# Altium schematic sheet 7.EEPROM.SchDoc: EEPROM
size A; SheetNumber: 7; SheetTotal: 16
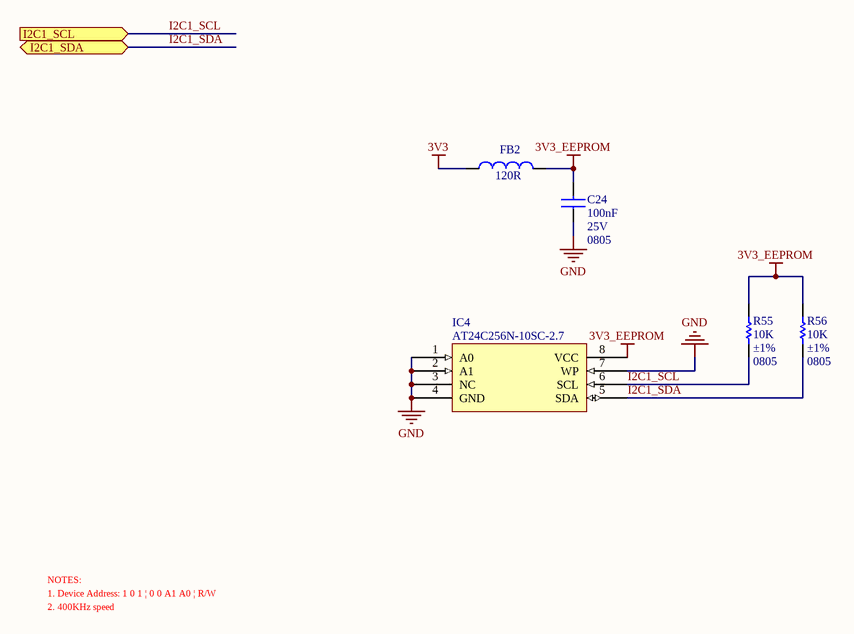
[diagram p0: 7.EEPROM.SchDoc]

## Parts
C24  Capacitance: 100nF  Voltage - Rated: 25V  Package / Case: 0805  [CAPC2012X100N_EIA0805]  (hidden comment: CAP_NP)
FB2  Impedance: 120R  [FILC2012X100N_EIA0805]  (hidden comment: BEAD)
IC4  Manufacturer Part Number: AT24C256N-10SC-2.7  [SOIC127P600X175-8N]  (hidden comment: AT24C256)
R55  Resistance (Ohm): 10K  Tolerance: ±1%  Package / Case: 0805  [RESC2013X65N_EIA0805]  (hidden comment: RES)
R56  Resistance (Ohm): 10K  Tolerance: ±1%  Package / Case: 0805  [RESC2013X65N_EIA0805]  (hidden comment: RES)

## Ports
I2C1_SCL (in), I2C1_SDA (bidir)

## Nets
3V3: FB2.1
3V3_EEPROM: C24.2 FB2.2 IC4.8(VCC) R55.1 R56.1
GND: C24.1 IC4.1(A0) IC4.2(A1) IC4.3(NC) IC4.4(GND) IC4.7(WP)
I2C1_SCL: IC4.6(SCL) R55.2 ; port I2C1_SCL
I2C1_SDA: IC4.5(SDA) R56.2 ; port I2C1_SDA

## Notes on the sheet
- NOTES:
- 1. Device Address: 1 0 1 | 0 0 A1 A0 | R/W
- 2. 400KHz speed

## Library data of the parts
C24 = SCAP00300093: CAP CER 0.1UF 25V X7R 0805; Manufacturer: Samsung Electro-Mechanics America, Inc.; Manufacturer Part Number: CL21B104KACNNNC; Value: 100nF; Tolerance: ±10%; Type: Multi Layer Ceramic Capacitor  (MLCC); Cost x1 ($): 0.10000; Cost x10 ($): 0.03300; Cost x100 ($): 0.01470; Cost x1000 ($): 0.00825; Distrubutor: Digikey; Lead Time: 11 Weeks; Part Number: SCAP00300093; Temperature Coefficient: X7R; Operating Temperature: -55°C ~ 125°C; Mounting Type: Surface Mount, MLCC; Size / Dimension: 0.079" L x 0.049" W (2.00mm x 1.25mm); Category: Capacitors; Family: Ceramic Capacitors; Distributor Part Number: 1276-1099-1-ND; Distributor Link: http://www.digikey.com/product-detail/en/samsung-electro-mechanics-america-inc/CL21B104KACNNNC/1276-1099-1-ND/3889185; ROHS: YES; Moisture Sensitivity Level (MSL): 1 (Unlimited); Quantity: 50
FB2 = SFIL00005: FERRITE CHIP POWER 120 OHM SMD; Manufacturer: Laird-Signal Integrity Products; Manufacturer Part Number: HI0805O121R-10; Type: Differential Mode - Single; Current Rating: 3.5A; DC Resistance (DCR): 20 mOhm Max; Cost x10 ($): 0.08700; Cost x100 ($): 0.05230; Cost x1000 ($): 0.03010; Distrubutor: Digikey; Cost x1 ($): 0.10000; Part Number: SFIL00005; Package / Case: 0805 (2012 Metric); Value: BEAD; Category: Filters; Family: Ferrite Beads and Chips; Distributor Part Number: 240-2393-1-ND; ROHS: YES; Datasheet Link: http://www.digikey.com/product-detail/en/HI0805O121R-10/240-2393-1-ND/806753; Quantity: 50
IC4 = SMEM00019: IC EEPROM 256KBIT 1MHZ 8SOIC; Manufacturer: Atmel; Voltage: 2.7 V ~ 5.5 V; Memory Size: 256K (32K x 8); Speed: 400kHz, 1MHz; Interface: I²C, 2-Wire Serial; Format - Memory: EEPROMs - Serial; Cost x10 ($): 0.55000; Cost x100 ($): 0.48290; Cost x1000 ($): 0.45477; Distrubutor: Digikey; Cost x1 ($): 0.60000; Part Number: SMEM00019; Value: AT24C256; Package: SMD; Operating Temperature: 0°C ~ 70°C (TA); Category: Integrated Circuits (ICs); Family: Memory; Memory Type: EEPROM; Package / Case: 8-SOIC (0.154", 3.90mm Width); Distributor Part Number: AT24C256N-10SC2.7-ND; Distributor Link: http://www.digikey.com/product-detail/en/atmel/AT24C256N-10SC-2.7/AT24C256N-10SC2.7-ND/398095; ROHS: YES; MSL: 1 (Unlimited); Quantity: 20
R55 R56 = SRES03010098: RES SMD 10K OHM 1% 1/8W 0805; Manufacturer: Yageo; Manufacturer Part Number: RC0805FR-0710KL; Power (Watts): 0.125W, 1/8W; Cost x1 ($): 0.10; Cost x10 ($): 0.21; Cost x100 ($): 0.84; Cost x1000 ($): 3.79; Distrubutor: Digikey; Part Number: SRES03010098; Value: 10K; Category: Resistors; Family: Chip Resistor - Surface Mount; Distributor Part Number: 311-10.0KCRCT-ND; Distributor Link: http://www.digikey.com/product-detail/en/RC0805FR-0710KL/311-10.0KCRCT-ND/730482; ROHS: YES; Quantity: 0